# EAGLE design board (EAGLE 8.7.1)
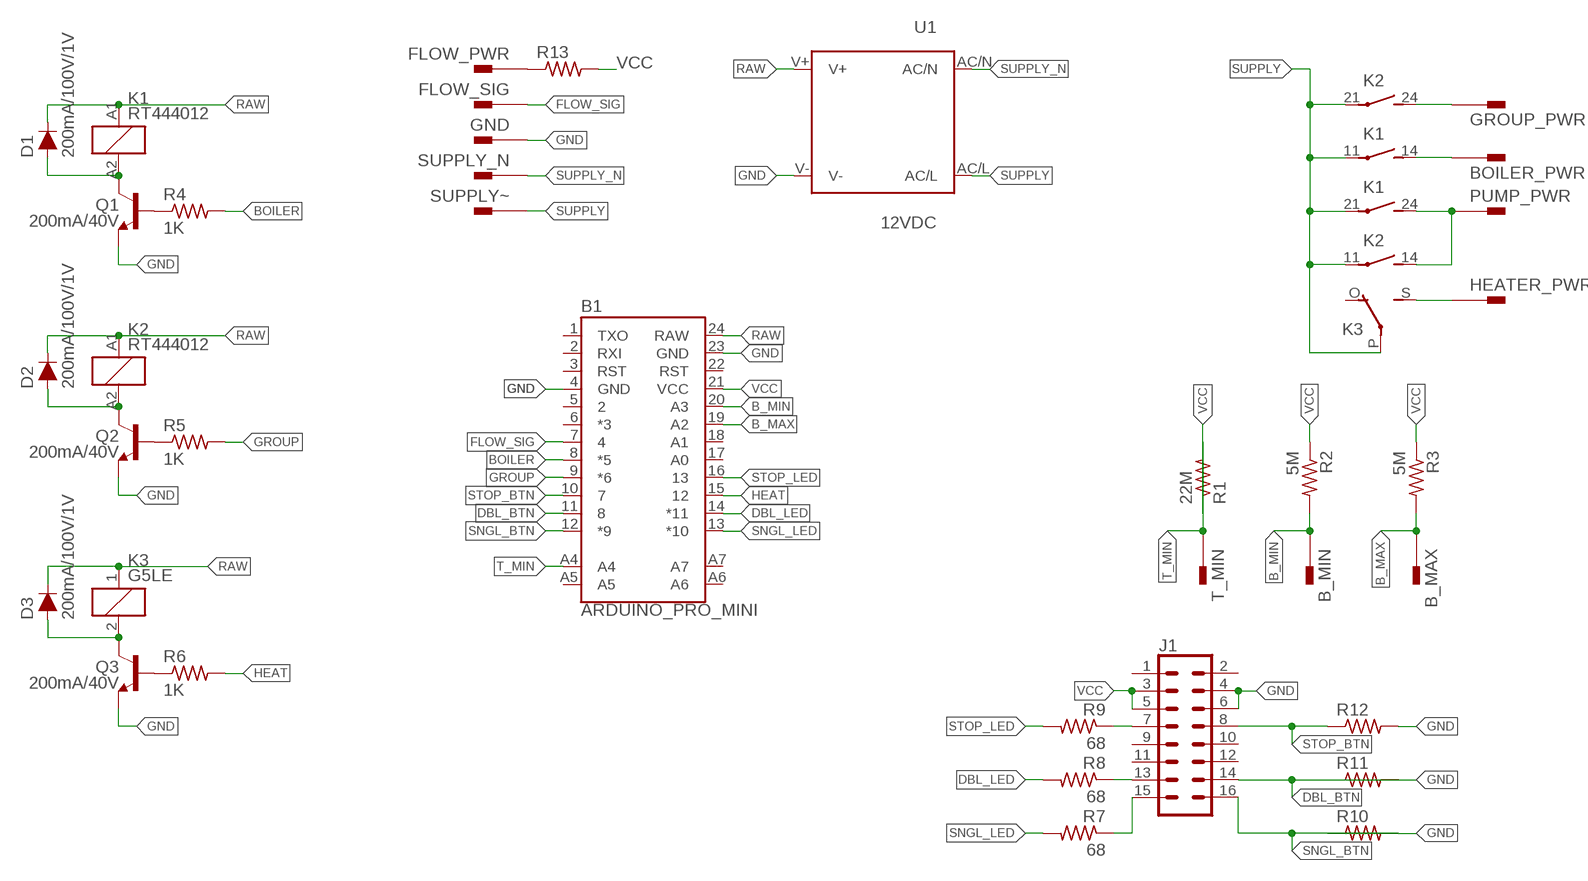
[diagram p0: schematic, sheet 1]

## Parts
B1  ARDUINO_PRO_MINI  [ARDUINO_PRO_MINI]
B_MAX  PIN2F061.040  [F061.040]
B_MIN  PIN2F061.040  [F061.040]
BOILER_PWR  PIN2F061.040  [F061.040]
D1  200mA/100V/1V  DIODE-1N4148  [DIODE-1N4148]
D2  200mA/100V/1V  DIODE-1N4148  [DIODE-1N4148]
D3  200mA/100V/1V  DIODE-1N4148  [DIODE-1N4148]
FLOW_PWR  PIN2F061.040  [F061.040]
FLOW_SIG  PIN2F061.040  [F061.040]
GND  PIN2F061.040  [F061.040]
GROUP_PWR  PIN2F061.040  [F061.040]
HEATER_PWR  PIN2F061.040  [F061.040]
J1  CONN_08X2  [2X8]
K1  RT444012  [RT2N/O]
K2  RT444012  [RT2N/O]
K3  G5LE  [G5LE]
PUMP_PWR  PIN2F061.040  [F061.040]
Q1  200mA/40V  TRANS_NPN-2N3904  [TO-92]
Q2  200mA/40V  TRANS_NPN-2N3904  [TO-92]
Q3  200mA/40V  TRANS_NPN-2N3904  [TO-92]
R1  22M  R-US_0207/7  [0207/7]
R2  5M  R-US_0207/7  [0207/7]
R3  5M  R-US_0207/7  [0207/7]
R4  1K  R-US_0207/7  [0207/7]
R5  1K  R-US_0207/7  [0207/7]
R6  1K  R-US_0207/7  [0207/7]
R7  68  R-US_0207/7  [0207/7]
R8  68  R-US_0207/7  [0207/7]
R9  68  R-US_0207/7  [0207/7]
R10  R-US_0207/7  [0207/7]
R11  R-US_0207/7  [0207/7]
R12  R-US_0207/7  [0207/7]
R13  R-US_0207/7  [0207/7]
SUPPLY_N  PIN2F061.040  [F061.040]
SUPPLY~  PIN2F061.040  [F061.040]
T_MIN  PIN2F061.040  [F061.040]
U1  12VDC  IRM_05/10  [IRM_05/10]

## Nets
B_MAX: B1.19(A2) B_MAX.A1 B_MAX.A2 R3.2
B_MIN: B1.20(A3) B_MIN.A1 B_MIN.A2 R2.2
BOILER: B1.8(*5) R4.2
DBL_BTN: B1.11 J1.14 R11.2
DBL_LED: B1.14(*11) R8.2
FLOW_SIG: B1.7 FLOW_SIG.A1 FLOW_SIG.A2
GND: B1.4(GND) B1.23(GND) GND.A1 GND.A2 J1.4 J1.6 Q1.1(E) Q2.1(E) Q3.1(E) R10.1 R11.1 R12.2 U1.V-
GROUP: B1.9(*6) R5.2
HEAT: B1.15 R6.2
N$2: GROUP_PWR.A1 GROUP_PWR.A2 K2.24(3:S)
N$3: FLOW_PWR.A1 FLOW_PWR.A2 R13.1
N$5: Q1.2(B) R4.1
N$9: Q2.2(B) R5.1
N$10: K1.24(3:S) K2.14(2:S) PUMP_PWR.A1 PUMP_PWR.A2
N$12: HEATER_PWR.A1 HEATER_PWR.A2 K3.S(2:S)
N$13: Q3.2(B) R6.1
N$14: J1.7 R9.1
N$16: D3.A K3.2 Q3.3(C)
N$18: D2.A K2.A2 Q2.3(C)
N$19: BOILER_PWR.A1 BOILER_PWR.A2 K1.14(2:S)
N$20: D1.A K1.A2 Q1.3(C)
N$23: J1.13 R8.1
N$24: J1.15 R7.1
RAW: B1.24(RAW) D1.C D2.C D3.C K1.A1 K2.A1 K3.1 U1.V+
SNGL_BTN: B1.12(*9) J1.16 R10.2
SNGL_LED: B1.13(*10) R7.2
STOP_BTN: B1.10 J1.8 R12.1
STOP_LED: B1.16 R9.2
SUPPLY: K1.11(2:P) K1.21(3:P) K2.11(2:P) K2.21(3:P) K3.P(2:P) SUPPLY~.A1 SUPPLY~.A2 U1.AC/L
SUPPLY_N: SUPPLY_N.A1 SUPPLY_N.A2 U1.AC/N
T_MIN: B1.A4 R1.2 T_MIN.A1 T_MIN.A2
VCC: B1.21(VCC) J1.3 J1.5 R1.1 R2.1 R3.1 R13.2
Unconnected: B1.1(TXO) B1.2(RXI) B1.3(RST) B1.5 B1.6(*3) B1.17(A0) B1.18(A1) B1.22(RST) B1.A5 B1.A6 B1.A7 J1.1 J1.2 J1.9 J1.10 J1.11 J1.12 K3.O(2:O)

## Library data of the parts
B1 = SparkFun-Boards:ARDUINO_PRO_MINI: SparkFun Pro Mini Pro Mini compatible footprint. Dimensions: 0.7 x 1.3" PCB Thickness: 0.8mm SparkFun Products: 3.3V/8MHz <https://www.sparkfun.com/products/11114> 5V/16MHz <https://www.sparkfun.com/products/11113>
B_MAX B_MIN BOILER_PWR FLOW_PWR FLOW_SIG GND GROUP_PWR HEATER_PWR PUMP_PWR SUPPLY_N SUPPLY~ T_MIN = con-faston:PIN2: Flachstecker Typ Tyco/Electronics/AMP TAB, FASTON Printed Circuit Board Tabs Source: http://www.buerklin.com, http://catalog.tycoelectronics.com; OC_FARNELL: unknown; OC_NEWARK: unknown
D1-D3 = SparkFun-DiscreteSemi:DIODE: Diode These are standard reverse protection diodes and small signal diodes. SparkFun Products: SparkFun SparkPunk Sound Kit <https://www.sparkfun.com/products/11177> SparkFun ESP8266 Thing <https://www.sparkfun.com/products/13231>; PROD_ID: DIO-08378
J1 = SparkFun-Connectors:CONN_08X2: Multi connection point. Often used as Generic Header-pin footprint for 0.1 inch spaced/style header connections You can populate with any combo of single row headers, but if you'd like an exact match, check this: Header - 2x8 (Male, 0.1") <https://www.sparkfun.com/products/13156> (PRT-13156) On any of the 0.1 inch spaced packages, you can populate with these: Break Away Headers - Straight <https://www.sparkfun.com/products/116> (PRT-00116) Break Away Male Headers - Right Angle <https://www.sparkfun.com/products/553> (PRT-00553) Female Headers <https://www.sparkfun.com/products/115> (PRT-00115) Break Away Headers - Machine Pin <https://www.sparkfun.com/products/117> (PRT-00117) Break Away Female Headers - Swiss Machine Pin <https://www.sparkfun.com/products/743> (PRT-00743)
K1 K2 = relay:RT44?*: Power PCB Relay SCHRACK 2 pole 8 A, DC and AC-coil Source: http://www.schrack.com/.. 5842.pdf; OC_FARNELL: unknown; OC_NEWARK: unknown
K3 = relay:G5LE: RELAY 1 x switch, 10 A/120 V AC, 8 A/30 V DC, Omron; OC_FARNELL: unknown; OC_NEWARK: unknown
Q1-Q3 = SparkFun-DiscreteSemi:TRANS_NPN: NPN transistor Current controlled devices typically used to amplify current or used as a switch. BC547 - COM-08928 <http://www.sparkfun.com/products/8928> (TO-92 45V 100mA) (1.Collector 2.Base 3.Emitter) 2N3904 - COM-00521 <http://www.sparkfun.com/products/521> (TO-92 40V 200mA) (1.Emitter 2.Base 3.Collector) P2N2222A - COM-12852 <http://www.sparkfun.com/products/12852> (TO-92 40V 600mA) (1.Collector 2.Base 3.Emitter); PROD_ID: TRANS-08447
R1-R13 = rcl:R-US_: RESISTOR, American symbol; SPICEPREFIX: R
U1 = meanwell_irm_v5:IRM_05/10: 5 or 10 watt housing & pin compatible IRM 05 Vout [V] Imax [A] Pmax [W] Eff [%] 3.3 1.25 4.125 68 5 1 5 71 12 0.42 5.04 75 15 0.33 4.95 75 24 0.23 5.52 77 IRM 10 Vout [V] Imax [A] Pmax [W] Eff [%] 3.3 2.5 8.25 74 5 2 10 77 12 0.85 10.2 82 15 0.67 10.05 82 24 0.42 10.08 82

## Board
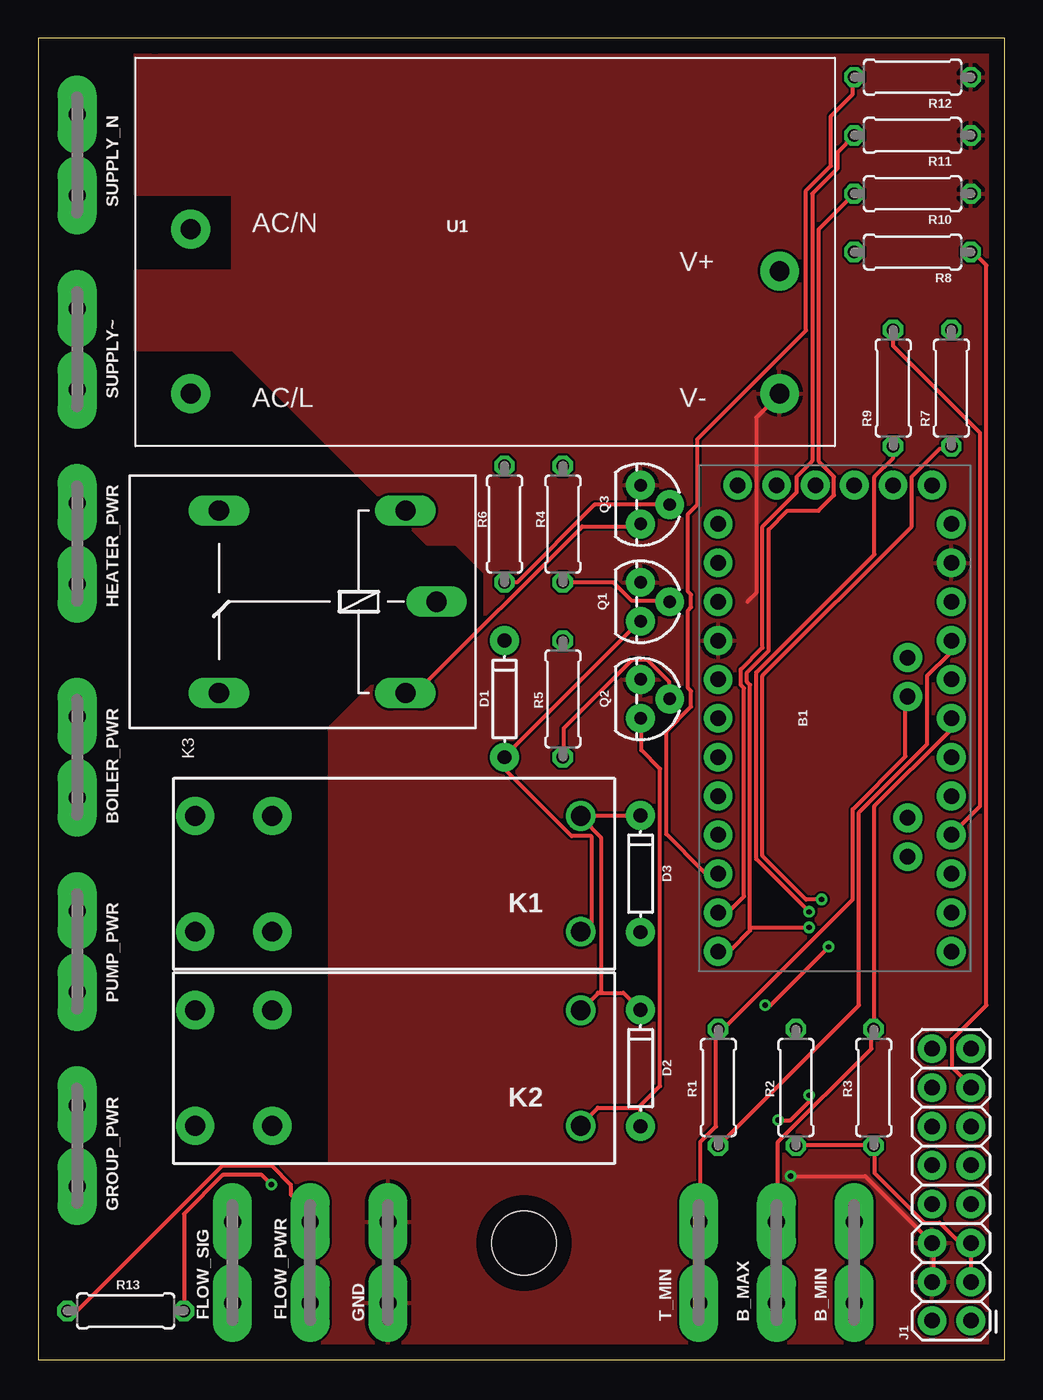
[diagram p1: board, top side]
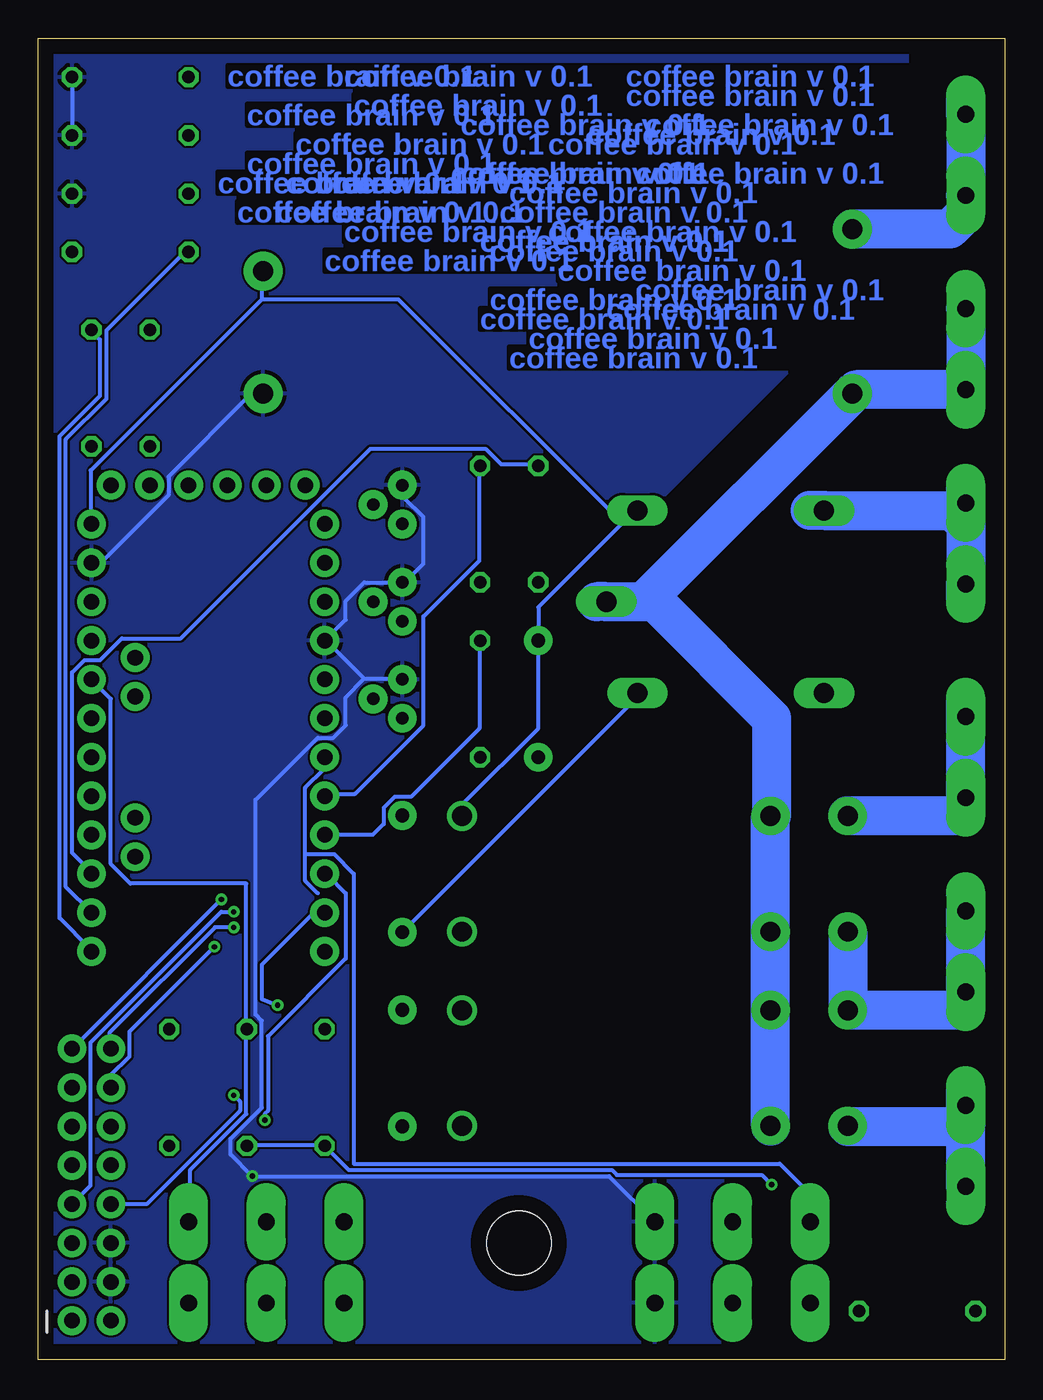
[diagram p2: board, bottom side, seen from below]

Size 63.17 x 86.36 mm. Coordinates in mm from the lower left corner, seen from the top.
Outline: 0,0 63.17,0 63.17,86.35 7.62,86.36 0,86.36 0,0
Copper layers (1*16): Top 0.035mm / dielectric 1.5mm / Bottom 0.035mm
Design rules "default *": minimum track width 10mil, minimum drill 0.35mm, track to track 6mil, track to pad 6mil, pad to pad 6mil, via to via 6mil, smd to smd 6mil, copper to edge 40mil, drill to drill 6mil, minimum pad ring 10mil, minimum via ring 8mil, stop-mask expansion 4mil, vias tented up to drill 0mil, thermal gap 10mil
Holes 4.2 mm at 31.75,7.62

### Footprints (pad centres in the part's own frame; a part is rotated, then mirrored left to right if it is on the bottom)
ARDUINO_PRO_MINI = drill 1.016 pad 1.88: 1 -7.62,12.7; 2 -7.62,10.16; 3 -7.62,7.62; 4 -7.62,5.08; 5 -7.62,2.54; 6 -7.62,0; 7 -7.62,-2.54; 8 -7.62,-5.08; 9 -7.62,-7.62; 10 -7.62,-10.16; 11 -7.62,-12.7; 12 -7.62,-15.24; 13 7.62,-15.24; 14 7.62,-12.7; 15 7.62,-10.16; 16 7.62,-7.62; 17 7.62,-5.08; 18 7.62,-2.54; 19 7.62,0; 20 7.62,2.54; 21 7.62,5.08; 22 7.62,7.62; 23 7.62,10.16; 24 7.62,12.7; A4 4.763,1.429; A5 4.763,3.969; A6 4.763,-9.049; A7 4.763,-6.509; BLK -6.35,15.24; GND -3.81,15.24; GRN 6.35,15.24; RXI 1.27,15.24; TXO 3.81,15.24; VCC -1.27,15.24
F061.040 = drill 1.1 pad 2.54 long: A1 -2.65,0; A2 2.65,0
DIODE-1N4148 = drill 0.9 pad 1.88: A -3.81,0; C 3.81,0
2X8 = drill 1.016 pad 1.88: 1 0,0; 2 0,2.54; 3 2.54,0; 4 2.54,2.54; 5 5.08,0; 6 5.08,2.54; 7 7.62,0; 8 7.62,2.54; 9 10.16,0; 10 10.16,2.54; 11 12.7,0; 12 12.7,2.54; 13 15.24,0; 14 15.24,2.54; 15 17.78,0; 16 17.78,2.54
RT2N/O = drill 1.3 pad 2.5: 11 7.56,-3.78; 14 12.6,-3.78; 21 7.56,3.78; 24 12.6,3.78 | drill 1.3: A1 -12.6,-3.78; A2 -12.6,3.78
G5LE = drill 1.321 long: 1 -7.493,-5.969; 2 -7.493,5.969; O 4.699,5.969; P -9.525,0; S 4.699,-5.969
TO-92 = drill 0.813 pad 1.88: 1 -1.27,0; 2 0,1.905; 3 1.27,0
0207/7 = drill 0.813 octagon: 1 -3.81,0; 2 3.81,0
IRM_05/10 = drill 1.3 pad 2.54: AC/L -19.25,-9.25; AC/N -19.25,1.5; V+ 19.25,-1.25; V- 19.25,-9.25

### Placement (x,y rotation side)
B1  52.07,41.91 0 top
B_MAX  48.26,6.35 90 top
B_MIN  53.34,6.35 90 top
BOILER_PWR  2.54,39.37 270 top
D1  30.48,43.18 90 top
D2  39.37,19.05 90 top
D3  39.37,31.75 90 top
FLOW_PWR  17.78,6.35 90 top
FLOW_SIG  12.7,6.35 90 top
GND  22.86,6.35 90 top
GROUP_PWR  2.54,13.97 270 top
HEATER_PWR  2.54,53.34 270 top
J1  60.96,2.54 90 top
K1  22.86,31.75 180 top
K2  22.86,19.05 180 top
K3  16.51,49.53 180 top
PUMP_PWR  2.54,26.67 270 top
Q1  39.37,49.53 270 top
Q2  39.37,43.18 270 top
Q3  39.37,55.88 270 top
R1  44.45,17.78 90 top
R2  49.53,17.78 90 top
R3  54.61,17.78 90 top
R4  34.29,54.61 90 top
R5  34.29,43.18 90 top
R6  30.48,54.61 90 top
R7  59.69,63.5 90 top
R8  57.15,72.39 180 top
R9  55.88,63.5 90 top
R10  57.15,76.2 180 top
R11  57.15,80.01 180 top
R12  57.15,83.82 0 top
R13  5.71,3.17 0 top
SUPPLY_N  2.54,78.74 270 top
SUPPLY~  2.54,66.04 270 top
T_MIN  43.18,6.35 90 top
U1  29.21,72.39 0 top

### Tracks (layer width: path | path; a pad name or v marks a point on that pad's centre or on a via)
B_MAX
  Top 0.254: B1.19 59.54,41.86 59.54,41.05 54.66,36.17 54.66,21.74 R3.2 54.46,21.54 54.46,20.32 48.36,14.22 48.36,9.14 B_MAX.A2 48.36,8.94 48.36,3.86 B_MAX.A1
B_MIN
  Top 0.254: B_MIN.A1 53.44,3.86 53.44,8.94 B_MIN.A2
  Bottom 0.254: B_MIN.A2 53.24,9.14 53.24,12.39 49.58,16.05 49.58,21.54 R2.2 49.58,21.74 49.58,31.11 57.15,31.11 58.42,32.38 58.42,43.18 B1.20
BOILER
  Bottom 0.254: R4.2 34.34,58.32 34.34,52.22 38,48.56 38,41.45 42.47,36.98 44.3,36.98 B1.8
DBL_BTN  (via drill 0.35)
  Top 0.254: B1.11 44.5,29.26 45.11,29.26 46.13,30.28 46.13,43.89 45.92,44.09 45.92,45.11 47.35,46.53 47.35,54.46 49.58,56.69 49.58,57.71 50.6,58.73 50.6,76.2 52.22,77.83 52.22,78.89 R11.2 | v47.52,23.16 47.85,23.16 v51.66,26.98
  Bottom 0.254: v47.52,23.16 48.56,23.57 48.56,25.81 45.31,29.06 44.5,29.06 B1.11 | J1.14 58.42,18.6 57.2,19.82 57.2,21.44 v51.66,26.98
DBL_LED
  Bottom 0.254: B1.14 61.37,30.89 61.37,60.15 58.73,62.79 58.73,67.26 53.44,72.54 R8.2
FLOW_SIG
  Top 0.254: FLOW_SIG.A1 FLOW_SIG.A2
  Bottom 0.254: 45.72,33.02 45.72,31.29 44.91,30.48 | 45.72,33.02 45.72,37.39 44.5,38.61 44.5,39.22 B1.7 | 45.72,33.02 43.81,33.02 42.55,31.75 42.55,12.8 14.71,12.8 12.7,10.79 FLOW_SIG.A2
GND  (via drill 0.35)
  Top 0.254: 44.5,47.75 44.5,47.14 B1.4 | U1.V- 48.36,62.99 46.94,61.57 46.94,50.11 46.35,49.53 | J1.4 58.52,5.08 58.52,7.52 J1.6 54.05,11.99 v49.17,11.99 | GND.A1 22.91,3.23 22.91,8.31 GND.A2
  Bottom 0.254: 41.86,44.5 39.42,44.5 Q2.1 | 41.86,44.5 44.3,46.94 B1.4 43.08,48.36 43.08,49.58 41.86,50.8 Q1.1 39.22,50.8 38,52.02 38,55.07 39.22,56.29 39.22,57.1 Q3.1 | B1.23 59.54,52.22 58.93,52.22 54.66,56.49 54.66,57.71 49.38,62.99 48.56,62.99 U1.V- | 41.86,44.5 43.08,43.28 43.08,41.45 43.89,40.64 44.91,40.64 48.97,36.58 48.97,22.55 48.56,22.15 48.56,16.46 50.6,14.43 50.6,13.41 v49.17,11.99 25.85,11.99 GND.A2 | R12.2 R11.1
  pour Bottom: 6.35,86.36 63.5,86.36 63.5,0 0,0 0,6.35 3.81,6.35 10.16,12.7 19.05,12.7 19.05,41.27 24.13,46.35 27.94,46.35 29.21,47.62 29.21,51.44 27.3,53.34 25.4,53.34 12.7,66.04 6.35,66.04 6.35,71.12 12.7,71.12 12.7,76.2 6.35,76.2
  pour Top: 63.5,86.36 6.35,86.36 6.35,76.2 12.7,76.2 12.7,71.12 6.35,71.12 6.35,66.04 12.7,66.04 25.4,53.34 27.3,53.34 29.21,51.44 29.21,47.62 27.94,46.35 24.13,46.35 19.05,41.27 19.05,12.7 10.16,12.7 3.81,6.35 0,6.35 0,0 63.5,0
GROUP
  Bottom 0.254: R5.2 34.34,46.94 34.34,41.25 38.81,36.78 39.88,36.78 40.59,36.06 40.59,35 41.3,34.29 B1.9
HEAT
  Bottom 0.254: R6.2 30.48,58.52 32.92,58.52 33.93,59.54 41.45,59.54 53.85,47.14 57.71,47.14 59.13,45.72 60.15,45.72 60.96,44.91 60.96,33.12 59.74,31.9 B1.15
N$2
  Bottom 2.54: 2.54,10.16 GROUP_PWR.A2 2.54,15.24 | 2.54,15.24 10.23,15.24 K2.24 | 2.54,17.78 GROUP_PWR.A1 2.54,15.24
N$3
  Top 0.254: R13.1 2.54,3.17 12.06,12.7 15.24,12.7 16.51,11.43 16.51,10.79 17.78,9.53 FLOW_PWR.A2 FLOW_PWR.A1
N$5
  Top 0.254: R4.1 37.59,50.8 38.81,49.58 41.25,49.58 Q1.2
N$9
  Top 0.254: R5.1 34.34,39.42 34.34,41.25 38.81,45.72 39.83,45.72 41.25,44.3 41.25,43.28 Q2.2
N$10
  Bottom 2.54: K1.24 K2.14 2.57,22.83 2.57,23.99 PUMP_PWR.A2 PUMP_PWR.A1 2.54,30.48
N$12
  Bottom 2.54: 2.54,49.53 HEATER_PWR.A2 2.54,54.61 | 2.54,54.61 HEATER_PWR.A1 2.54,57.15 | 2.54,54.61 3.43,55.5 K3.S 12.7,55.5
N$13
  Top 0.254: R6.1 31.29,50.8 36.37,55.88 Q3.2
N$14  (via drill 0.35)
  Top 0.254: R9.1 55.88,58.93 54.66,57.71 54.66,52.63 46.94,44.91 46.94,32.72 v50.39,29.26
  Bottom 0.254: v50.39,29.26 51.21,29.26 59.74,20.73 59.74,11.38 J1.7
N$16
  Top 0.254: Q3.3 39.22,54.46 35.56,54.46 24.79,43.69 24.18,43.69 K3.2
  Bottom 0.254: K3.2 24.18,43.48 24.18,43.13 D3.A
N$18
  Top 0.254: 39.22,16.46 36.58,16.46 35.56,15.44 K2.A2 | Q2.3 39.42,41.86 39.42,39.83 40.64,38.61 40.64,17.88 39.37,16.61 | 39.37,16.61 D2.A 39.37,16.31 39.22,16.46 | 39.22,16.46 39.37,16.61
N$19
  Bottom 2.54: 2.54,35.56 BOILER_PWR.A2 BOILER_PWR.A1 2.54,43.18 | 2.54,35.56 2.57,35.53 | K1.14 10.23,35.56 2.54,35.56
N$20
  Top 0.254: Q1.3 39.22,48.16 30.48,39.42 D1.A 30.48,38.61 34.87,34.22 36.12,34.22 36.2,34.15 36.2,28.57 36.06,28.57 K1.A2
N$23
  Top 0.254: R8.1 60.96,72.54 61.98,71.53 61.98,23.16 59.74,20.93 59.74,19.1 60.96,17.88 J1.13
N$24  (via drill 0.35)
  Top 0.254: v51.21,30.07 50.19,30.07 47.35,32.92 47.35,44.7 57.1,54.46 57.1,57.71 58.93,59.54 59.54,59.54 R7.1
  Bottom 0.254: J1.15 v51.21,30.07
RAW
  Top 0.254: 36.58,23.98 36.61,23.98 | 35.56,22.96 K2.A1 | 36.78,23.98 36.78,34.14 35.56,35.36 K1.A1 35.49,35.56 D3.C | K2.A1 35.49,22.86 | K2.A1 36.61,23.98 | 36.61,23.98 36.78,23.98 | 36.78,23.98 38.25,23.98 D2.C
  Bottom 0.254: 48.56,69.29 59.74,58.12 59.74,54.66 B1.24 | 48.56,69.29 48.56,71.12 U1.V+ | 24.99,54.66 24.18,55.47 K3.1 24.99,54.66 | 24.99,54.66 30.48,49.17 D1.C 30.48,41.25 35.36,36.37 35.36,35.56 K1.A1 | 48.56,69.29 39.62,69.29 24.99,54.66
SNGL_BTN  (via drill 0.35)
  Top 0.254: 46.53,28.25 46.53,28.04 45.31,26.82 44.5,26.82 B1.12 | 46.53,28.25 46.53,44.09 46.33,44.3 46.33,44.91 47.75,46.33 47.75,54.25 48.97,55.47 51,55.47 52.02,56.49 52.02,57.71 51,58.73 51,73.86 R10.2 | 46.53,28.25 v50.39,28.25
  Bottom 0.254: v50.39,28.25 51.61,28.25 58.52,21.34 58.52,20.32 J1.16
SNGL_LED
  Bottom 0.254: R7.2 59.74,67.26 59.16,66.67 59.13,66.67 59.13,62.99 61.77,60.35 61.77,28.85 59.74,26.82 B1.13
STOP_BTN  (via drill 0.35)
  Top 0.254: R12.1 53.24,83.72 53.24,82.7 51.82,81.28 51.82,78.03 50.19,76.4 50.19,67.26 43.08,60.15 43.08,55.88 42.47,55.27 42.47,50.19 42.67,49.99 42.67,49.17 42.47,48.97 42.47,43.89 42.67,43.69 42.67,42.67 41.05,41.05 41.05,34.34 43.48,31.9 44.3,31.9 B1.10 | v50.39,17.27 50.39,16.87 49.17,15.65 v48.36,15.65
  Bottom 0.254: J1.8 56.08,10.16 49.99,16.26 49.99,16.87 v50.39,17.27 | v48.36,15.65 48.36,16.05 48.16,16.26 48.16,21.13 43.08,26.21 43.08,30.48 44.3,31.7 B1.10
STOP_LED
  Top 0.254: R9.2 55.88,66.24 61.57,60.55 61.57,36.17 B1.16
SUPPLY
  Bottom 2.54: SUPPLY~.A1 SUPPLY~.A2 | SUPPLY~.A2 2.54,62.23 | K2.21 K2.11 K1.21 K1.11 15.24,35.59 15.24,41.91 22.86,49.53 23.57,49.53 | SUPPLY~.A2 9.71,63.39 U1.AC/L 23.57,49.53 | 23.57,49.53 K3.P 26.67,49.53
SUPPLY_N
  Bottom 2.54: 2.54,82.55 SUPPLY_N.A1 SUPPLY_N.A2 2.54,74.93 3.58,73.89 U1.AC/N
T_MIN
  Top 0.254: B1.A4 56.69,43.28 56.69,39.42 53.24,35.97 53.24,30.07 44.91,21.74 44.5,21.74 R1.2 44.3,21.54 44.3,15.24 43.28,14.22 43.28,9.14 T_MIN.A2 43.28,8.94 43.28,3.86 T_MIN.A1
VCC  (via drill 0.35)
  Top 0.254: J1.3 J1.5 60.96,7.72 60.15,7.72 58.93,8.94 57.91,8.94 54.66,12.19 54.66,13.82 R3.1 54.46,14.02 49.58,14.02 R2.1 | R1.1 53.65,23.16 53.65,35.76 58.12,40.23 58.12,44.7 59.54,46.13 59.54,46.94 B1.21 | v15.24,11.43 14.61,12.06 12.06,12.06 9.53,9.53 R13.2
  Bottom 0.254: R2.1 49.38,14.02 44.5,14.02 R1.1 42.88,12.39 25.68,12.39 25.35,12.06 15.88,12.06 v15.24,11.43

### Text on the board
Bottom: coffee brain v 0.1 | coffee brain v 0.1 | coffee brain v 0.1 | coffee brain v 0.1 | coffee brain v 0.1 | coffee brain v 0.1 | coffee brain v 0.1 | coffee brain v 0.1 | coffee brain v 0.1 | coffee brain v 0.1 | coffee brain v 0.1 | coffee brain v 0.1 | coffee brain v 0.1 | coffee brain v 0.1 | coffee brain v 0.1 | coffee brain v 0.1 | coffee brain v 0.1 | coffee brain v 0.1 | coffee brain v 0.1 | coffee brain v 0.1 | coffee brain v 0.1 | coffee brain v 0.1 | coffee brain v 0.1 | coffee brain v 0.1 | coffee brain v 0.1 | coffee brain v 0.1 | coffee brain v 0.1 | coffee brain v 0.1 | coffee brain v 0.1 | coffee brain v 0.1 | coffee brain v 0.1 | coffee brain v 0.1 | coffee brain v 0.1 | coffee brain v 0.1 | coffee brain v 0.1
Pads: coffee brain v 0.1 | by stewart jackson